# EAGLE design rc2014_6502 (EAGLE 8.1.1)
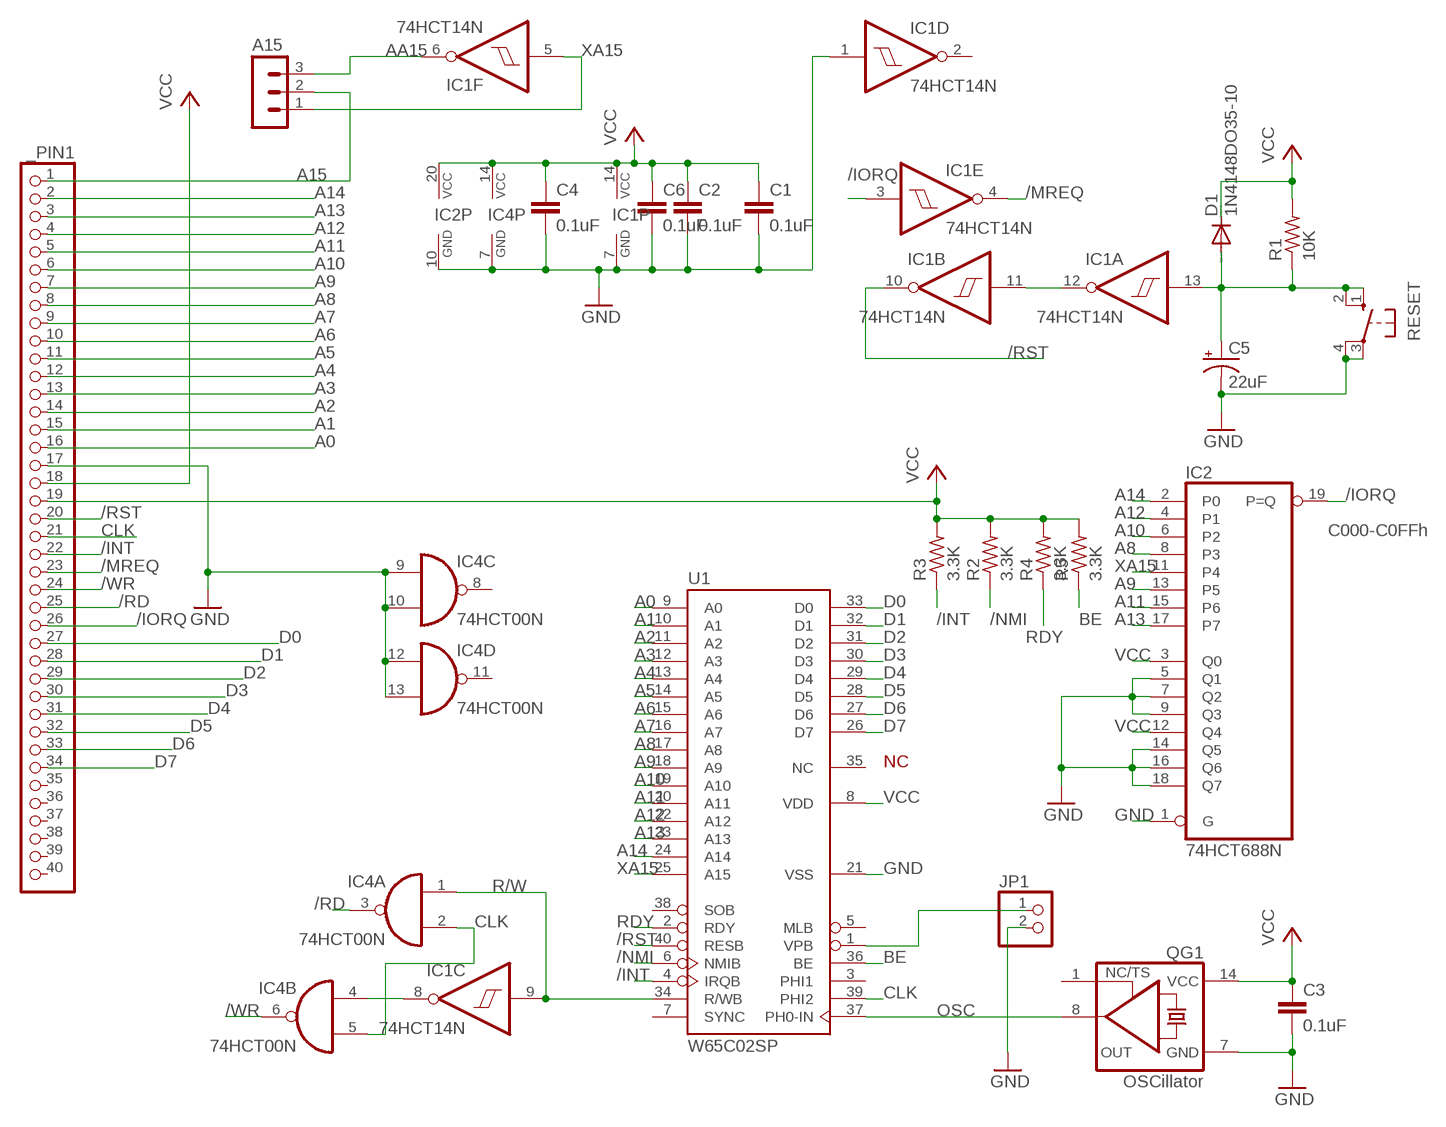
[diagram p0: schematic, sheet 1]

## Parts
_PIN1  PINHD-1X40  [1X40]
A15  MA03-1  [MA03-1]
C1  0.1uF  C-EU050-024X044  [C050-024X044]
C2  0.1uF  C-EU050-024X044  [C050-024X044]
C3  0.1uF  C-EU050-024X044  [C050-024X044]
C4  0.1uF  C-EU050-024X044  [C050-024X044]
C5  22uF  CPOL-USTAP5-80  [TAP5-80]
C6  0.1uF  C-EU050-024X044  [C050-024X044]
D1  1N4148DO35-10  [DO35-10]
IC1  74HCT14N  [DIL14]
IC2  74HCT688N  [DIL20]
IC4  74HCT00N  [DIL14]
JP1  PINHD-1X2  [1X02]
QG1  OSCillator  XO-14  [DIL14S]
R1  10K  R-US_0207/10  [0207/10]
R2  3.3K  R-US_0207/10  [0207/10]
R3  3.3K  R-US_0207/10  [0207/10]
R4  3.3K  R-US_0207/10  [0207/10]
R5  3.3K  R-US_0207/10  [0207/10]
RESET  10-XX  [B3F-10XX]
U1  W65C02SP  [DIP-40]

## Nets
/INT: _PIN1.22 R3.1 U1.4(IRQB)
/IORQ: _PIN1.26 IC1.3(E:I) IC2.19(P=Q)
/MREQ: _PIN1.23 IC1.4(E:O)
/NMI: R2.1 U1.6(NMIB)
/RD: _PIN1.25 IC4.3(A:O)
/RST: _PIN1.20 IC1.10(B:O) U1.40(RESB)
/WR: _PIN1.24 IC4.6(B:O)
A0: _PIN1.16 U1.9(A0)
A1: _PIN1.15 U1.10(A1)
A2: _PIN1.14 U1.11(A2)
A3: _PIN1.13 U1.12(A3)
A4: _PIN1.12 U1.13(A4)
A5: _PIN1.11 U1.14(A5)
A6: _PIN1.10 U1.15(A6)
A7: _PIN1.9 U1.16(A7)
A8: _PIN1.8 IC2.8(P3) U1.17(A8)
A9: _PIN1.7 IC2.13(P5) U1.18(A9)
A10: _PIN1.6 IC2.6(P2) U1.19(A10)
A11: _PIN1.5 IC2.15(P6) U1.20(A11)
A12: _PIN1.4 IC2.4(P1) U1.22(A12)
A13: _PIN1.3 IC2.17(P7) U1.23(A13)
A14: _PIN1.2 IC2.2(P0) U1.24(A14)
A15: _PIN1.1 A15.2
AA15: A15.3 IC1.6(F:O)
BE: R5.1 U1.36(BE)
CLK: _PIN1.21 IC4.2(A:I1) IC4.5(B:I1) U1.39(PHI2)
D0: _PIN1.27 U1.33(D0)
D1: _PIN1.28 U1.32(D1)
D2: _PIN1.29 U1.31(D2)
D3: _PIN1.30 U1.30(D3)
D4: _PIN1.31 U1.29(D4)
D5: _PIN1.32 U1.28(D5)
D6: _PIN1.33 U1.27(D6)
D7: _PIN1.34 U1.26(D7)
GND: _PIN1.17 C1.2 C2.2 C3.2 C4.2 C5.- C6.2 IC1.1(D:I) IC1.7(P:GND) IC2.1(G) IC2.5(Q1) IC2.7(Q2) IC2.9(Q3) IC2.10(GND) IC2.14(Q5) IC2.16(Q6) IC2.18(Q7) IC4.7(P:GND) IC4.9(C:I0) IC4.10(C:I1) IC4.12(D:I0) IC4.13(D:I1) JP1.2 QG1.7(GND) RESET.3(P) RESET.4(P1) U1.21(VSS)
N$1: IC1.8(C:O) IC4.4(B:I0)
N$3: JP1.1 U1.1(VPB)
N$15: IC1.11(B:I) IC1.12(A:O)
OSC: QG1.8(OUT) U1.37(PH0-IN)
R/W: IC1.9(C:I) IC4.1(A:I0) U1.34(R/WB)
RDY: R4.1 U1.2(RDY)
RESET: C5.+ D1.A IC1.13(A:I) R1.1 RESET.1(S) RESET.2(S1)
VCC: _PIN1.18 _PIN1.19 C1.1 C2.1 C3.1 C4.1 C6.1 D1.C IC1.14(P:VCC) IC2.3(Q0) IC2.12(Q4) IC2.20(VCC) IC4.14(P:VCC) QG1.14(VCC) R1.2 R2.2 R3.2 R4.2 R5.2 U1.8(VDD)
XA15: A15.1 IC1.5(F:I) IC2.11(P4) U1.25(A15)
Unconnected: _PIN1.35 _PIN1.36 _PIN1.37 _PIN1.38 _PIN1.39 _PIN1.40 IC1.2(D:O) IC4.8(C:O) IC4.11(D:O) QG1.1(TS) U1.3(PHI1) U1.5(MLB) U1.7(SYNC) U1.35(NC) U1.38(SOB)

## Notes on the sheet
- C000-C0FFh

## Library data of the parts
_PIN1 = pinhead:PINHD-1X40: PIN HEADER
A15 = con-lstb:MA03-1: PIN HEADER; OC_FARNELL: unknown; OC_NEWARK: unknown
C1-C4 C6 = rcl:C-EU: CAPACITOR, European symbol
C5 = rcl:CPOL-US: POLARIZED CAPACITOR, American symbol
D1 = diode:1N4148: DIODE high speed (Philips)
IC1 = 74xx-eu:74*14: Hex schmitt trigger INVERTER
IC2 = 74xx-eu:74*688: 8-bit MAGNITUDE/IDENTITY COMPARATOR, totem pole
IC4 = 74xx-eu:74*00: Quad 2-input NAND gate
JP1 = pinhead:PINHD-1X2: PIN HEADER
QG1 = crystal:XO-: CRYSTAL; OC_FARNELL: unknown; OC_NEWARK: unknown
R1-R5 = rcl:R-US_: RESISTOR, American symbol
RESET = switch-omron:10-XX: OMRON SWITCH; MPN: B3F-1000; OC_FARNELL: 176432; OC_NEWARK: 36M3542
U1 = 65xxx:W65C02SP: Western Digital Version

## Net classes
0 +5V: width 0.508 mm

## Board
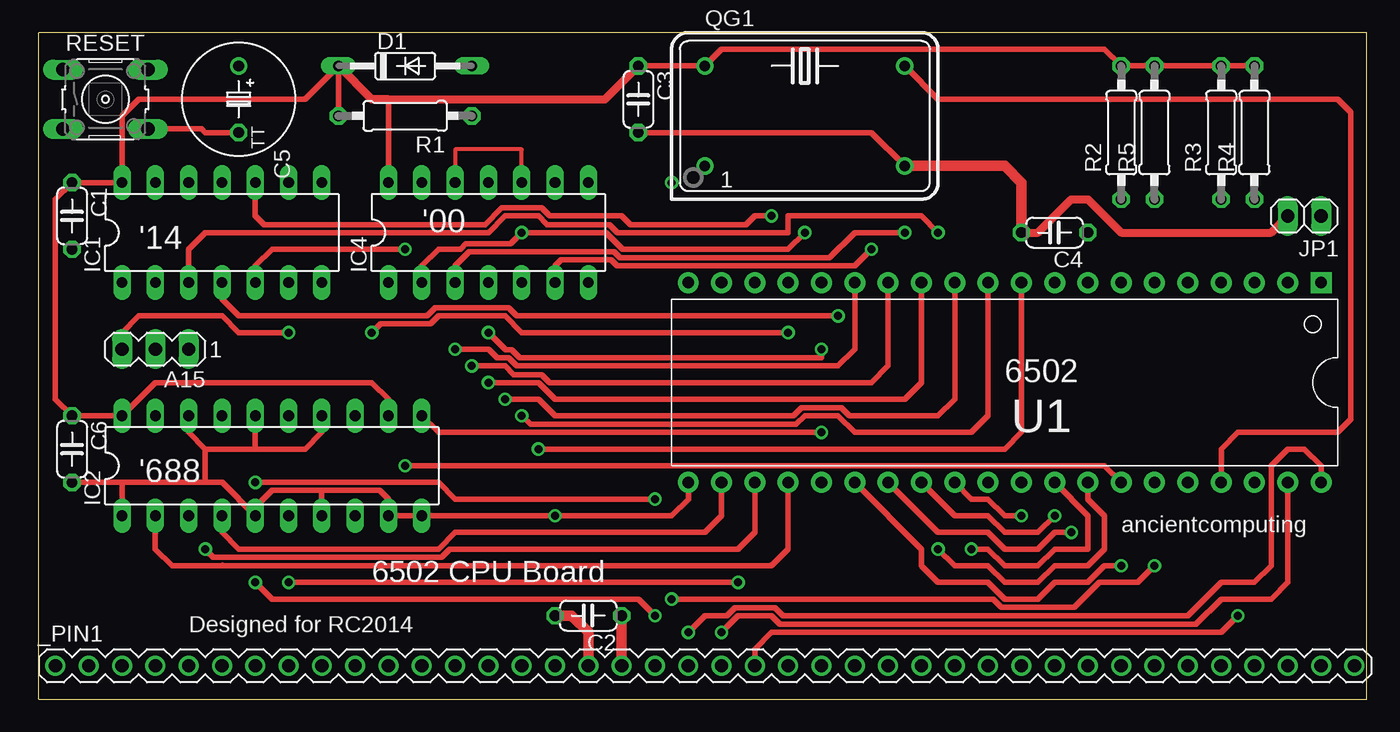
[diagram p1: board, top side]
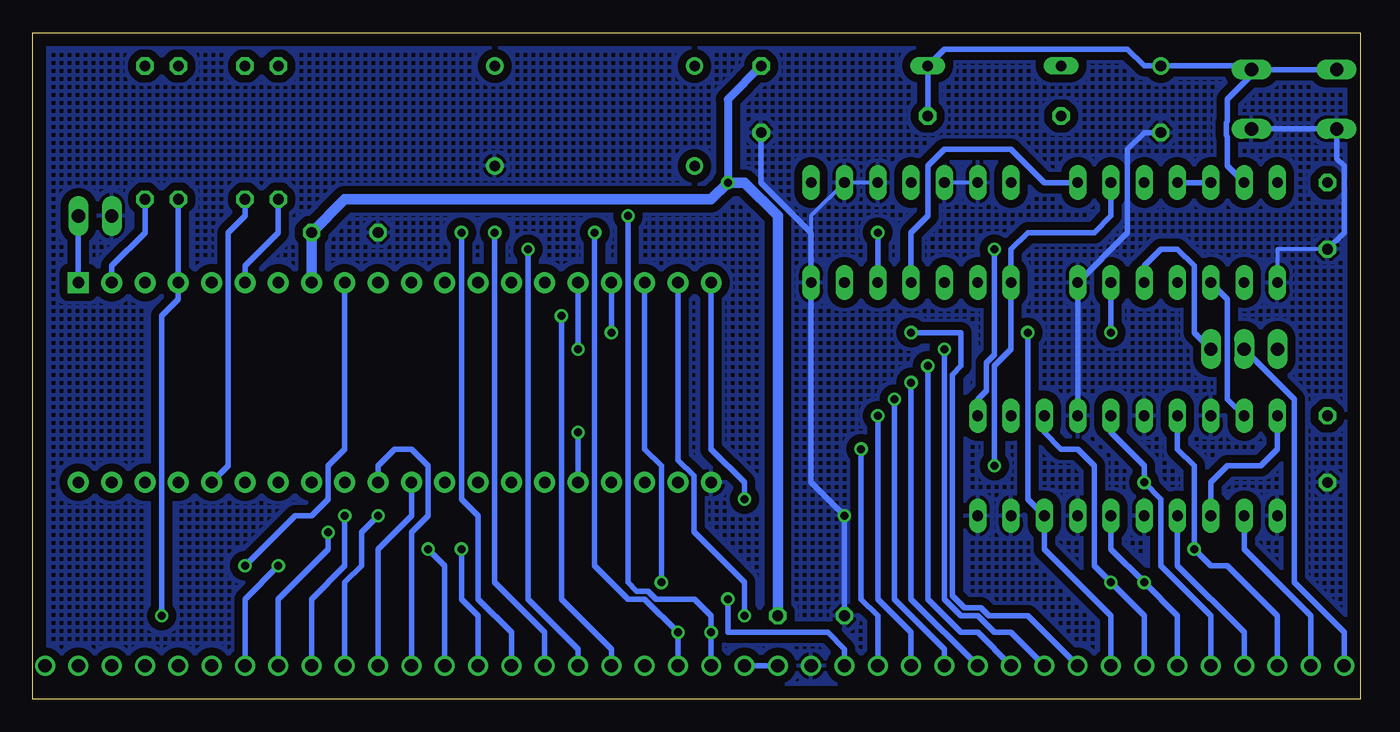
[diagram p2: board, bottom side, seen from below]

Size 101.27 x 50.79 mm. Coordinates in mm from the lower left corner, seen from the top.
Outline: 0,0 101.27,0 101.27,50.79 0,50.79 0,0
Copper layers (1*16): Top 0.035mm / dielectric 1.5mm / Bottom 0.035mm
Design rules "default *": minimum track width 20mil, minimum drill 24mil, track to track 8mil, track to pad 8mil, pad to pad 8mil, via to via 8mil, smd to smd 8mil, copper to edge 40mil, drill to drill 8mil, minimum pad ring 10mil, minimum via ring 8mil, stop-mask expansion 4mil, vias tented up to drill 0mil, thermal gap 10mil

### Footprints (pad centres in the part's own frame; a part is rotated, then mirrored left to right if it is on the bottom)
1X40 = drill 1.016: 1 -49.53,0; 2 -46.99,0; 3 -44.45,0; 4 -41.91,0; 5 -39.37,0; 6 -36.83,0; 7 -34.29,0; 8 -31.75,0; 9 -29.21,0; 10 -26.67,0; 11 -24.13,0; 12 -21.59,0; 13 -19.05,0; 14 -16.51,0; 15 -13.97,0; 16 -11.43,0; 17 -8.89,0; 18 -6.35,0; 19 -3.81,0; 20 -1.27,0; 21 1.27,0; 22 3.81,0; 23 6.35,0; 24 8.89,0; 25 11.43,0; 26 13.97,0; 27 16.51,0; 28 19.05,0; 29 21.59,0; 30 24.13,0; 31 26.67,0; 32 29.21,0; 33 31.75,0; 34 34.29,0; 35 36.83,0; 36 39.37,0; 37 41.91,0; 38 44.45,0; 39 46.99,0; 40 49.53,0
MA03-1 = drill 1.016 long: 1 -2.54,0; 2 0,0; 3 2.54,0
C050-024X044 = drill 0.813 octagon: 1 -2.54,0; 2 2.54,0
TAP5-80 = drill 0.813: + -2.54,0 | drill 0.813 octagon: - 2.54,0
DO35-10 = drill 0.813 long: A 5.08,0; C -5.08,0
DIL14 = drill 0.813 long: 1 -7.62,-3.81; 2 -5.08,-3.81; 3 -2.54,-3.81; 4 0,-3.81; 5 2.54,-3.81; 6 5.08,-3.81; 7 7.62,-3.81; 8 7.62,3.81; 9 5.08,3.81; 10 2.54,3.81; 11 0,3.81; 12 -2.54,3.81; 13 -5.08,3.81; 14 -7.62,3.81
DIL20 = drill 0.813 long: 1 -11.43,-3.81; 2 -8.89,-3.81; 3 -6.35,-3.81; 4 -3.81,-3.81; 5 -1.27,-3.81; 6 1.27,-3.81; 7 3.81,-3.81; 8 6.35,-3.81; 9 8.89,-3.81; 10 11.43,-3.81; 11 11.43,3.81; 12 8.89,3.81; 13 6.35,3.81; 14 3.81,3.81; 15 1.27,3.81; 16 -1.27,3.81; 17 -3.81,3.81; 18 -6.35,3.81; 19 -8.89,3.81; 20 -11.43,3.81
1X02 = drill 1.016 long: 1 -1.27,0; 2 1.27,0
DIL14S = drill 0.813: 1 -7.62,-3.81; 7 7.62,-3.81; 8 7.62,3.81; 14 -7.62,3.81
0207/10 = drill 0.813 octagon: 1 -5.08,0; 2 5.08,0
B3F-10XX = drill 1.016 long: 1 -3.251,2.261; 2 3.251,2.261; 3 -3.251,-2.261; 4 3.251,-2.261
DIP-40 = drill 0.889 pad 1.6 square: 1 -22.86,-7.62 | drill 0.889 pad 1.6: 2 -20.32,-7.62; 3 -17.78,-7.62; 4 -15.24,-7.62; 5 -12.7,-7.62; 6 -10.16,-7.62; 7 -7.62,-7.62; 8 -5.08,-7.62; 9 -2.54,-7.62; 10 0,-7.62; 11 2.54,-7.62; 12 5.08,-7.62; 13 7.62,-7.62; 14 10.16,-7.62; 15 12.7,-7.62; 16 15.24,-7.62; 17 17.78,-7.62; 18 20.32,-7.62; 19 22.86,-7.62; 20 25.4,-7.62; 21 25.4,7.62; 22 22.86,7.62; 23 20.32,7.62; 24 17.78,7.62; 25 15.24,7.62; 26 12.7,7.62; 27 10.16,7.62; 28 7.62,7.62; 29 5.08,7.62; 30 2.54,7.62; 31 0,7.62; 32 -2.54,7.62; 33 -5.08,7.62; 34 -7.62,7.62; 35 -10.16,7.62; 36 -12.7,7.62; 37 -15.24,7.62; 38 -17.78,7.62; 39 -20.32,7.62; 40 -22.86,7.62

### Placement (x,y rotation side)
_PIN1  50.8,2.54 0 top
A15  8.89,26.67 180 top
C1  2.54,36.83 270 top
C2  41.91,6.35 180 top
C3  45.72,45.72 270 top
C4  77.47,35.56 180 top
C5  15.24,45.72 270 top
C6  2.54,19.05 270 top
D1  27.94,48.26 0 top
IC1  13.97,35.56 0 top
IC2  17.78,17.78 0 top
IC4  34.29,35.56 0 top
JP1  96.52,36.83 180 top
QG1  58.42,44.45 0 top
R1  27.94,44.45 180 top
R2  82.55,43.18 90 top
R3  90.17,43.18 90 top
R4  92.71,43.18 90 top
R5  85.09,43.18 90 top
RESET  5.08,45.72 0 top
U1  74.93,24.13 180 top

### Tracks (layer width: path | path; a pad name or v marks a point on that pad's centre or on a via)
/INT  (via drill 0.61)
  Top 0.406: v91.44,6.35 90.17,5.08 55.88,5.08 54.61,3.81 _PIN1.22
  Bottom 0.406: R3.1 U1.4 90.17,30.48 91.44,29.21 v91.44,6.35
/IORQ  (via drill 0.61)
  Top 0.406: v68.58,35.56 67.31,36.83 57.15,36.83 57.15,35.56 44.12,35.56 43.52,36.17 38.76,36.17 38.1,36.83 35.56,36.83 34.29,35.56 12.7,35.56 11.43,34.29 IC1.3
  Bottom 0.406: _PIN1.26 64.77,5.08 67.31,7.62 67.31,13.97 68.58,15.24 v68.58,35.56 | IC2.19 10.16,22.86 10.16,30.48 IC1.3
/MREQ  (via drill 0.61)
  Top 0.406: v60.96,29.21 36.42,29.21 35.81,29.82 30.23,29.82 29.62,29.21 15.24,29.21 13.97,30.48 IC1.4
  Bottom 0.406: _PIN1.23 57.15,3.81 60.96,7.62 v60.96,29.21
/NMI
  Bottom 0.406: R2.1 82.55,35.56 85.09,33.02 U1.6
/RD  (via drill 0.61)
  Top 0.406: v66.04,35.56 62.23,35.56 60.3,33.63 44.33,33.63 43.87,34.09 32.82,34.09 31.75,33.02 IC4.3
  Bottom 0.406: _PIN1.25 62.23,5.08 66.04,8.89 v66.04,35.56
/RST  (via drill 0.61)
  Top 0.406: v49.53,5.08 50.8,6.35 52.48,6.35 53.09,6.96 56.13,6.96 56.74,6.35 87.63,6.35 90.17,8.89 92.71,8.89 93.98,10.16 93.98,17.78 95.25,19.05 96.52,19.05 97.79,17.78 U1.40 | IC1.10 16.51,36.83 17.17,36.17 34.04,36.17 35.31,37.44 38.35,37.44 38.96,36.83 44.45,36.83 45.11,36.17 53.95,36.17 54.61,36.83 v55.88,36.83
  Bottom 0.406: _PIN1.20 v49.53,5.08 49.53,6.35 50.8,7.62 53.75,7.62 54.36,8.23 55.22,8.23 55.88,8.89 v55.88,36.83
/WR  (via drill 0.61)
  Top 0.406: v63.5,34.29 62.23,33.02 44.08,33.02 43.62,33.48 39.83,33.48 39.37,33.02 IC4.6
  Bottom 0.406: _PIN1.24 59.69,3.81 63.5,7.62 v63.5,34.29
A0  (via drill 0.61)
  Top 0.406: v85.09,10.16 83.82,8.89 80.87,8.89 78.99,7.01 73.41,7.01 72.8,7.62 v48.26,7.62
  Bottom 0.406: U1.9 77.47,19.05 78.74,17.78 78.74,15.24 80.01,13.97 81.28,13.97 v85.09,10.16 | _PIN1.16 39.37,3.81 40.64,5.08 48.26,5.08 v48.26,7.62
A1  (via drill 0.61)
  Top 0.406: v38.1,19.05 73.66,19.05 74.93,20.32 U1.10
  Bottom 0.406: _PIN1.15 36.83,6.35 38.1,7.62 v38.1,19.05
A2  (via drill 0.61)
  Top 0.406: v36.83,21.59 37.49,20.93 57.76,20.93 58.42,21.59 60.96,21.59 62.23,20.32 71.12,20.32 72.39,21.59 U1.11
  Bottom 0.406: _PIN1.14 34.29,5.08 36.83,7.62 v36.83,21.59
A3  (via drill 0.61)
  Top 0.406: v35.56,22.86 38.1,22.86 39.37,21.59 57.56,21.59 58.17,22.2 61.21,22.2 61.82,21.59 68.58,21.59 69.85,22.86 U1.12
  Bottom 0.406: _PIN1.13 31.75,3.81 35.56,7.62 v35.56,22.86
A4  (via drill 0.61)
  Top 0.406: v34.29,24.13 38.1,24.13 39.37,22.86 66.04,22.86 67.31,24.13 U1.13
  Bottom 0.406: _PIN1.12 34.29,7.62 v34.29,24.13
A5  (via drill 0.61)
  Top 0.406: v33.02,25.4 35.56,25.4 36.22,24.74 38.35,24.74 38.96,24.13 63.5,24.13 64.77,25.4 U1.14
  Bottom 0.406: _PIN1.11 29.21,5.08 30.48,5.08 33.02,7.62 v33.02,25.4
A6  (via drill 0.61)
  Top 0.406: v31.75,26.67 34.29,26.67 34.95,26.01 35.81,26.01 36.42,25.4 60.96,25.4 62.23,26.67 U1.15
  Bottom 0.406: _PIN1.10 26.67,5.08 27.94,5.08 29.21,6.35 30.48,6.35 31.75,7.62 v31.75,26.67
A7  (via drill 0.61)
  Top 0.406: v34.29,27.94 35.61,26.62 36.06,26.62 36.67,26.01 59.69,26.01 v59.69,26.67
  Bottom 0.406: _PIN1.9 25.4,6.35 28.35,6.35 28.96,6.96 30.23,6.96 31.14,7.87 31.14,24.74 30.48,25.4 30.48,27.94 v34.29,27.94 | v59.69,26.67 U1.16
A8  (via drill 0.61)
  Top 0.406: v57.15,27.94 36.83,27.94 35.56,29.21 30.48,29.21 29.87,28.6 26.06,28.6 v25.4,27.94
  Bottom 0.406: IC2.8 24.13,12.7 | _PIN1.8 19.05,6.35 24.13,11.43 IC2.8 | U1.17 v57.15,27.94 | v25.4,27.94 25.4,15.24 IC2.8
A9  (via drill 0.61)
  Top 0.406: v53.34,8.89 v19.05,8.89
  Bottom 0.406: _PIN1.7 16.51,6.35 v19.05,8.89 20.32,10.16 20.32,17.78 21.59,19.05 22.86,19.05 24.13,20.32 IC2.13 | U1.18 54.61,19.05 53.34,17.78 v53.34,8.89
A10  (via drill 0.61)
  Top 0.406: v46.99,6.35 45.72,7.62 17.78,7.62 v16.51,8.89
  Bottom 0.406: IC2.6 19.05,11.43 v16.51,8.89 13.97,6.35 _PIN1.6 | U1.19 52.07,18.22 50.86,17.01 50.86,12.76 46.99,8.89 v46.99,6.35
A11  (via drill 0.61)
  Top 0.406: v46.99,15.24 31.75,15.24 30.48,16.51 v16.51,16.51
  Bottom 0.406: _PIN1.5 11.43,6.35 15.24,10.16 15.24,15.24 v16.51,16.51 16.51,17.78 19.05,20.32 IC2.15 | U1.20 49.53,19.05 46.99,16.51 v46.99,15.24
A12
  Top 0.406: IC2.4 13.97,12.7 15.24,11.43 30.48,11.43 31.75,12.7 50.8,12.7 52.07,13.97 U1.22
  Bottom 0.406: _PIN1.4 8.89,5.08 13.97,10.16 IC2.4
A13  (via drill 0.61)
  Top 0.406: v12.7,11.43 13.31,10.82 30.73,10.82 31.34,11.43 53.34,11.43 54.61,12.7 U1.23
  Bottom 0.406: _PIN1.3 6.35,6.35 10.16,10.16 11.43,10.16 v12.7,11.43 12.7,17.78 13.97,19.05 IC2.17
A14
  Top 0.406: 14.02,10.21 13.97,10.16 | 13.97,10.16 10.16,10.16 8.89,11.43 IC2.2 | 55.83,10.21 55.88,10.16 | 55.83,10.21 55.93,10.21 57.15,11.43 U1.24 | 13.97,10.16 55.78,10.16 55.83,10.21
  Bottom 0.406: _PIN1.2 3.81,6.35 8.89,11.43 IC2.2
A15
  Bottom 0.406: _PIN1.1 1.27,5.08 5.08,8.89 5.08,22.86 A15.2
AA15  (via drill 0.61)
  Top 0.406: A15.3 6.35,27.94 7.62,29.21 13.97,29.21 15.24,27.94 v19.05,27.94
  Bottom 0.406: IC1.6 v19.05,27.94
BE
  Bottom 0.406: R5.1 85.09,36.83 86.36,35.56 86.36,17.78 U1.36
CLK  (via drill 0.61)
  Top 0.406: v52.07,5.08 53.34,6.35 55.88,6.35 56.54,5.69 88.24,5.69 90.17,7.62 93.98,7.62 95.25,8.89 U1.39 | v58.42,35.56 57.15,34.29 44.53,34.29 43.26,35.56 v36.83,35.56 35.97,34.7 32.56,34.7 32.16,34.29 30.48,34.29 29.21,33.02 IC4.2
  Bottom 0.406: _PIN1.21 v52.07,5.08 54.61,7.62 55.88,7.62 58.42,10.16 v58.42,35.56 | IC4.5 v36.83,35.56
D0  (via drill 0.61)
  Top 0.406: v68.58,11.43 69.85,10.16 72.39,10.16 73.66,8.89 76.2,8.89 77.47,10.16 80.01,10.16 81.28,11.43 81.28,13.97 80.01,15.24 U1.33
  Bottom 0.406: _PIN1.27 67.31,6.35 68.58,7.62 v68.58,11.43
D1  (via drill 0.61)
  Top 0.406: v71.12,11.43 72.39,11.43 73.66,10.16 76.2,10.16 77.47,11.43 80.01,11.43 80.01,13.97 U1.32
  Bottom 0.406: v71.12,11.43 69.85,10.16 _PIN1.28
D2
  Bottom 0.406: U1.31 74.93,17.78 73.66,19.05 72.39,19.05 71.12,17.78 71.12,13.97 72.39,12.7 _PIN1.29
D3
  Bottom 0.406: _PIN1.30 74.93,11.43 72.39,13.97 U1.30
D4  (via drill 0.61)
  Top 0.406: U1.29 71.12,15.24 72.39,15.24 73.66,13.97 v74.93,13.97
  Bottom 0.406: _PIN1.31 77.47,8.89 76.2,10.16 76.2,12.7 v74.93,13.97
D5  (via drill 0.61)
  Top 0.406: U1.28 69.85,13.97 72.39,13.97 73.66,12.7 76.2,12.7 v77.47,13.97
  Bottom 0.406: _PIN1.32 80.01,7.62 77.47,10.16 v77.47,13.97
D6  (via drill 0.61)
  Top 0.406: U1.27 68.58,12.7 72.39,12.7 73.66,11.43 76.2,11.43 77.47,12.7 v78.74,12.7
  Bottom 0.406: _PIN1.33 82.55,7.62 78.74,11.43 v78.74,12.7
D7  (via drill 0.61)
  Top 0.406: v82.55,10.16 81.28,10.16 80.01,8.89 77.47,8.89 76.2,7.62 73.66,7.62 72.39,8.89 68.58,8.89 67.31,10.16 67.31,11.43 U1.26
  Bottom 0.406: _PIN1.34 85.09,7.62 v82.55,10.16
GND  (via drill 0.61)
  Top 0.305: IC4.12 31.75,41.91 36.83,41.91 IC4.10
  Top 0.406: U1.21 49.53,15.24 48.26,13.97 v39.37,13.97 IC2.10 IC2.9 26.67,15.24 26.01,15.9 21.59,15.9 | C3.2 63.5,43.18 QG1.7 | 21.59,15.9 17.78,15.9 16.51,14.63 IC2.5 13.97,16.51 12.7,16.51 | 21.59,15.9 IC2.7 | 12.7,16.51 6.35,16.51 | 6.35,16.51 IC2.1 | C6.2 6.35,16.51 | IC2.18 11.43,20.32 12.7,19.05 | 16.51,19.05 12.7,19.05 | 16.51,19.05 20.32,19.05 21.59,20.32 IC2.14 | IC2.16 16.51,19.05 | 12.7,19.05 12.7,16.51 | C5.- 12.7,43.18 12.42,43.46 RESET.4
  Top 0.61: C4.2 76.2,35.56 78.74,38.1 80.01,38.1 82.55,35.56 93.98,35.56 JP1.2
  Top 0.813: QG1.7 73.66,40.64 74.93,39.37 C4.2 | C2.2 40.64,6.35 41.91,5.08 _PIN1.17
  Bottom 0.305: IC4.13 IC4.12 | IC4.10 IC4.9 41.91,36.83 41.91,35.56 | C1.2 6.35,34.29 IC1.1
  Bottom 0.406: C2.2 v39.37,13.97 41.91,16.51 IC4.7 41.91,35.56 45.72,39.37 C3.2 | C1.2 1.27,35.56 1.27,40.64 1.83,41.2 RESET.3 RESET.4 | IC2.14 IC1.7 17.78,35.56 17.78,41.91 16.51,43.18 C5.-
  pour Bottom (isolate 0.61, hatched): 0,50.8 0,0 101.6,0 101.6,50.8
N$1
  Bottom 0.406: IC4.4 34.29,35.56 33.02,36.83 33.02,40.64 31.75,41.91 26.67,41.91 24.13,39.37 IC1.8
N$3
  Bottom 0.406: JP1.1 U1.1
N$15
  Bottom 0.406: IC1.12 IC1.11
OSC
  Top 0.406: QG1.8 68.58,45.72 99.06,45.72 100.05,44.73 100.05,21.31 99.06,20.32 91.44,20.32 90.17,19.05 U1.37
R/W  (via drill 0.61)
  Top 0.406: U1.34 81.28,17.78 v27.94,17.78
  Bottom 0.406: v27.94,17.78 27.94,25.4 26.67,26.67 IC4.1 26.67,34.29 25.4,35.56 20.32,35.56 19.05,36.83 IC1.9
RDY
  Bottom 0.406: R4.1 92.71,35.56 95.25,33.02 U1.2
RESET
  Top 0.406: RESET.2 8.33,47.7
  Bottom 0.406: RESET.2 8.61,48.26 C5.+ 16.51,48.26 17.78,49.53 31.75,49.53 D1.A R1.1 | RESET.2 RESET.1 | RESET.2 8.33,47.7 | RESET.2 8.33,47.55 10.16,45.72 10.16,44.05 10.26,43.94 10.26,42.98 10.16,42.87 10.16,40.64 IC1.13
VCC  (via drill 0.61)
  Top 0.406: R1.2 D1.C 20.32,45.72 7.62,45.72 6.35,44.45 IC1.14 C1.1 1.27,38.1 1.27,22.86 C6.1 IC2.20 8.89,24.13 25.4,24.13 26.67,22.86 IC2.12 | C3.1 QG1.14 52.07,49.53 81.28,49.53 R2.2 R5.2 R3.2 R4.2 | IC4.14 26.67,45.72
  Top 0.61: D1.C 25.4,45.72 26.67,45.72 43.18,45.72 C3.1
  Top 0.813: _PIN1.18 C2.1
  Bottom 0.406: IC2.20 6.35,19.05 7.62,17.78 10.16,17.78 11.43,16.51 IC2.3 | _PIN1.18 _PIN1.19
  Bottom 0.61: C3.1 48.26,45.72 v48.26,39.37
  Bottom 0.813: C2.1 44.45,36.83 46.99,39.37 v48.26,39.37 49.53,38.1 77.47,38.1 C4.1 U1.8
XA15  (via drill 0.61)
  Top 0.406: IC2.11 30.48,20.32 v59.69,20.32 | IC1.5 16.51,33.02 17.78,34.29 v27.94,34.29
  Bottom 0.406: U1.25 v59.69,20.32 | v27.94,34.29 27.94,26.26 28.55,25.65 28.55,23.52 29.21,22.86 IC2.11 | A15.1 12.7,27.94 12.7,33.02 13.97,34.29 15.24,34.29 16.51,33.02 IC1.5

### Text on the board
tNames: '00 | '14 | 6502 | '688 | ancientcomputing | 6502 CPU Board | Designed for RC2014